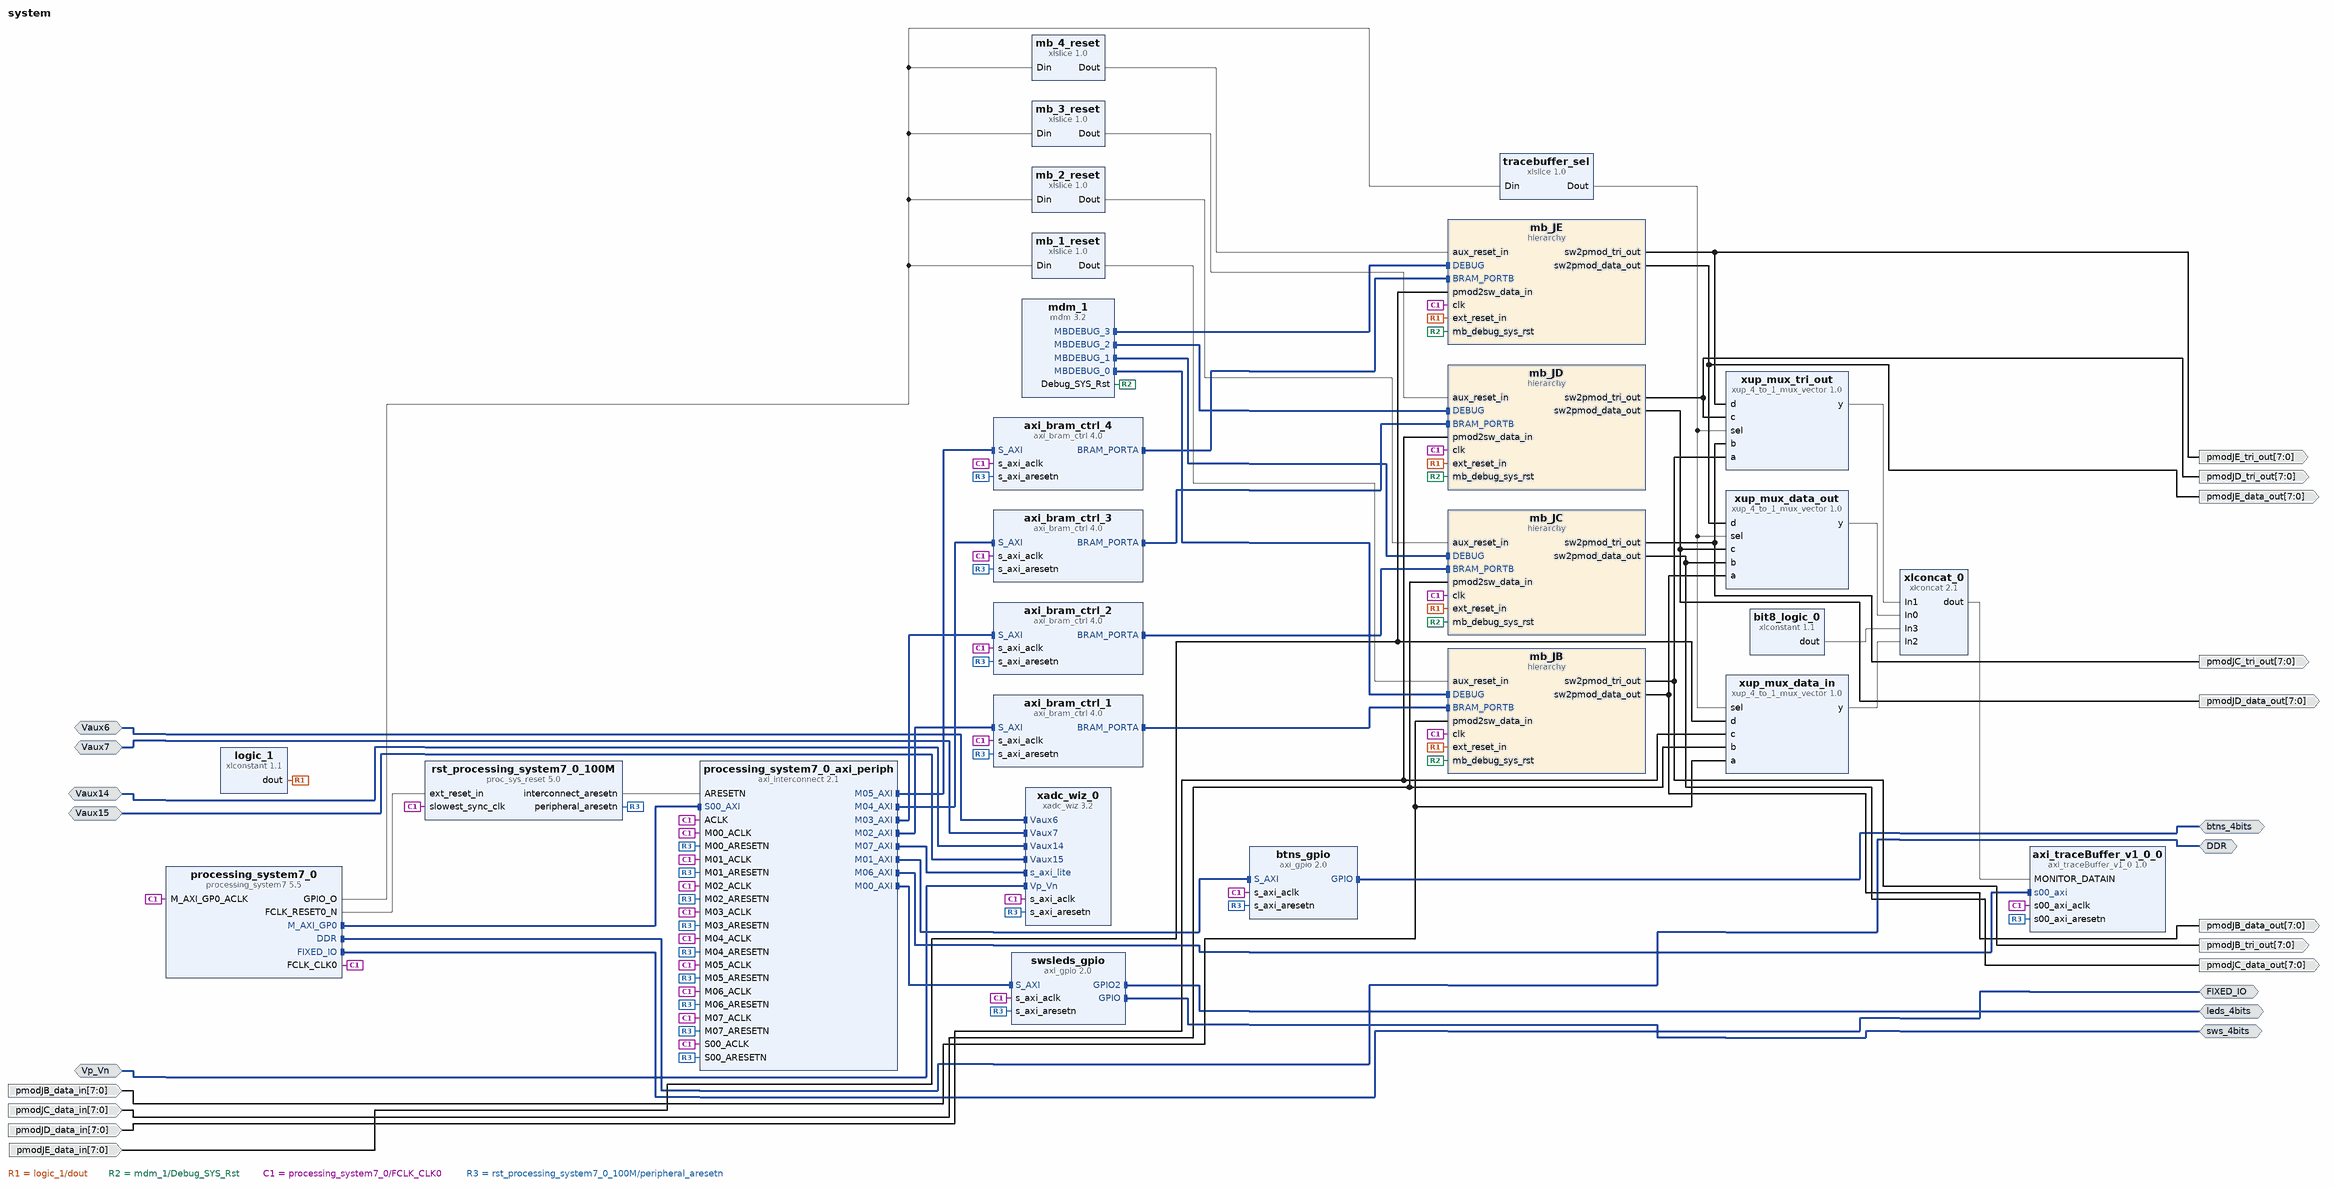
[diagram p0: block diagram of the top level]
# Vivado block design system, Vivado 2015.3
create_bd_design system

create_bd_intf_port -mode Master -vlnv xilinx.com:interface:ddrx_rtl:1.0 DDR
create_bd_intf_port -mode Master -vlnv xilinx.com:display_processing_system7:fixedio_rtl:1.0 FIXED_IO
create_bd_intf_port -mode Slave -vlnv xilinx.com:interface:diff_analog_io_rtl:1.0 Vaux6
create_bd_intf_port -mode Slave -vlnv xilinx.com:interface:diff_analog_io_rtl:1.0 Vaux7
create_bd_intf_port -mode Slave -vlnv xilinx.com:interface:diff_analog_io_rtl:1.0 Vaux14
create_bd_intf_port -mode Slave -vlnv xilinx.com:interface:diff_analog_io_rtl:1.0 Vaux15
create_bd_intf_port -mode Slave -vlnv xilinx.com:interface:diff_analog_io_rtl:1.0 Vp_Vn
create_bd_intf_port -mode Master -vlnv xilinx.com:interface:gpio_rtl:1.0 btns_4bits
create_bd_intf_port -mode Master -vlnv xilinx.com:interface:gpio_rtl:1.0 leds_4bits
create_bd_intf_port -mode Master -vlnv xilinx.com:interface:gpio_rtl:1.0 sws_4bits
create_bd_port -dir I -from 7 -to 0 pmodJB_data_in
create_bd_port -dir O -from 7 -to 0 pmodJB_data_out
create_bd_port -dir O -from 7 -to 0 pmodJB_tri_out
create_bd_port -dir I -from 7 -to 0 pmodJC_data_in
create_bd_port -dir O -from 7 -to 0 pmodJC_data_out
create_bd_port -dir O -from 7 -to 0 pmodJC_tri_out
create_bd_port -dir I -from 7 -to 0 pmodJD_data_in
create_bd_port -dir O -from 7 -to 0 pmodJD_data_out
create_bd_port -dir O -from 7 -to 0 pmodJD_tri_out
create_bd_port -dir I -from 7 -to 0 pmodJE_data_in
create_bd_port -dir O -from 7 -to 0 pmodJE_data_out
create_bd_port -dir O -from 7 -to 0 pmodJE_tri_out

create_bd_cell -type ip -vlnv xilinx.com:ip:axi_bram_ctrl:4.0 axi_bram_ctrl_1
set_property -dict {CONFIG.SINGLE_PORT_BRAM 1} [get_bd_cells axi_bram_ctrl_1]
create_bd_cell -type ip -vlnv xilinx.com:ip:axi_bram_ctrl:4.0 axi_bram_ctrl_2
set_property -dict {CONFIG.SINGLE_PORT_BRAM 1} [get_bd_cells axi_bram_ctrl_2]
create_bd_cell -type ip -vlnv xilinx.com:ip:axi_bram_ctrl:4.0 axi_bram_ctrl_3
set_property -dict {CONFIG.SINGLE_PORT_BRAM 1} [get_bd_cells axi_bram_ctrl_3]
create_bd_cell -type ip -vlnv xilinx.com:ip:axi_bram_ctrl:4.0 axi_bram_ctrl_4
set_property -dict {CONFIG.SINGLE_PORT_BRAM 1} [get_bd_cells axi_bram_ctrl_4]
create_bd_cell -type ip -vlnv xilinx.com:user:axi_traceBuffer_v1_0:1.0 axi_traceBuffer_v1_0_0
create_bd_cell -type ip -vlnv xilinx.com:ip:xlconstant:1.1 bit8_logic_0
set_property -dict {CONFIG.CONST_WIDTH 8 CONFIG.CONST_VAL 0} [get_bd_cells bit8_logic_0]
create_bd_cell -type ip -vlnv xilinx.com:ip:axi_gpio:2.0 btns_gpio
set_property -dict {CONFIG.C_GPIO_WIDTH 4 CONFIG.C_ALL_INPUTS 1} [get_bd_cells btns_gpio]
create_bd_cell -type ip -vlnv xilinx.com:ip:xlconstant:1.1 logic_1
create_bd_cell -type ip -vlnv xilinx.com:ip:xlslice:1.0 mb_1_reset
set_property -dict {CONFIG.DIN_TO 0 CONFIG.DIN_FROM 0 CONFIG.DIN_WIDTH 6} [get_bd_cells mb_1_reset]
create_bd_cell -type ip -vlnv xilinx.com:ip:xlslice:1.0 mb_2_reset
set_property -dict {CONFIG.DOUT_WIDTH 1 CONFIG.DIN_TO 1 CONFIG.DIN_FROM 1 CONFIG.DIN_WIDTH 6} [get_bd_cells mb_2_reset]
create_bd_cell -type ip -vlnv xilinx.com:ip:xlslice:1.0 mb_3_reset
set_property -dict {CONFIG.DOUT_WIDTH 1 CONFIG.DIN_TO 2 CONFIG.DIN_FROM 2 CONFIG.DIN_WIDTH 6} [get_bd_cells mb_3_reset]
create_bd_cell -type ip -vlnv xilinx.com:ip:xlslice:1.0 mb_4_reset
set_property -dict {CONFIG.DOUT_WIDTH 1 CONFIG.DIN_TO 3 CONFIG.DIN_FROM 3 CONFIG.DIN_WIDTH 6} [get_bd_cells mb_4_reset]
create_bd_cell -type hier mb_JB
create_bd_cell -type hier mb_JC
create_bd_cell -type hier mb_JD
create_bd_cell -type hier mb_JE
create_bd_cell -type ip -vlnv xilinx.com:ip:mdm:3.2 mdm_1
set_property -dict {CONFIG.C_MB_DBG_PORTS 4} [get_bd_cells mdm_1]
create_bd_cell -type ip -vlnv xilinx.com:ip:processing_system7:5.5 processing_system7_0
set_property -dict [list \
  CONFIG.PCW_UIPARAM_DDR_FREQ_MHZ 525 \
  CONFIG.PCW_CRYSTAL_PERIPHERAL_FREQMHZ 50.000000 \
  CONFIG.PCW_APU_PERIPHERAL_FREQMHZ 650 \
  CONFIG.PCW_SDIO_PERIPHERAL_FREQMHZ 50 \
  CONFIG.PCW_FPGA0_PERIPHERAL_FREQMHZ 100 \
  CONFIG.PCW_PRESET_BANK1_VOLTAGE {LVCMOS 1.8V} \
  CONFIG.PCW_UIPARAM_DDR_PARTNO {MT41K128M16 JT-125} \
  CONFIG.PCW_QSPI_PERIPHERAL_ENABLE 1 \
  CONFIG.PCW_QSPI_GRP_SINGLE_SS_ENABLE 1 \
  CONFIG.PCW_QSPI_GRP_FBCLK_ENABLE 1 \
  CONFIG.PCW_ENET0_PERIPHERAL_ENABLE 1 \
  CONFIG.PCW_ENET0_ENET0_IO {MIO 16 .. 27} \
  CONFIG.PCW_ENET0_GRP_MDIO_ENABLE 0 \
  CONFIG.PCW_SD0_PERIPHERAL_ENABLE 1 \
  CONFIG.PCW_SD0_GRP_CD_ENABLE 1 \
  CONFIG.PCW_SD0_GRP_CD_IO {MIO 47} \
  CONFIG.PCW_SD0_GRP_WP_ENABLE 1 \
  CONFIG.PCW_UART1_PERIPHERAL_ENABLE 1 \
  CONFIG.PCW_USB0_PERIPHERAL_ENABLE 0 \
  CONFIG.PCW_GPIO_MIO_GPIO_ENABLE 0 \
  CONFIG.PCW_GPIO_EMIO_GPIO_ENABLE 1 \
  CONFIG.PCW_GPIO_EMIO_GPIO_IO 6 \
] [get_bd_cells processing_system7_0]
# 71 more settings of processing_system7_0 are not shown: defaults, MIO pin electricals, DDR timing, and values the tool derives
create_bd_cell -type ip -vlnv xilinx.com:ip:axi_interconnect:2.1 processing_system7_0_axi_periph
set_property -dict {CONFIG.NUM_MI 8} [get_bd_cells processing_system7_0_axi_periph]
create_bd_cell -type ip -vlnv xilinx.com:ip:proc_sys_reset:5.0 rst_processing_system7_0_100M
create_bd_cell -type ip -vlnv xilinx.com:ip:axi_gpio:2.0 swsleds_gpio
set_property -dict [list \
  CONFIG.C_GPIO_WIDTH 4 \
  CONFIG.C_GPIO2_WIDTH 4 \
  CONFIG.C_IS_DUAL 1 \
  CONFIG.C_ALL_INPUTS 1 \
  CONFIG.C_ALL_OUTPUTS_2 1 \
] [get_bd_cells swsleds_gpio]
create_bd_cell -type ip -vlnv xilinx.com:ip:xlslice:1.0 tracebuffer_sel
set_property -dict {CONFIG.DOUT_WIDTH 2 CONFIG.DIN_TO 4 CONFIG.DIN_FROM 5 CONFIG.DIN_WIDTH 6} [get_bd_cells tracebuffer_sel]
create_bd_cell -type ip -vlnv xilinx.com:ip:xadc_wiz:3.2 xadc_wiz_0
set_property -dict [list \
  CONFIG.XADC_STARUP_SELECTION channel_sequencer \
  CONFIG.SEQUENCER_MODE Continuous \
  CONFIG.OT_ALARM false \
  CONFIG.USER_TEMP_ALARM false \
  CONFIG.VCCINT_ALARM false \
  CONFIG.VCCAUX_ALARM false \
  CONFIG.ENABLE_VCCPINT_ALARM false \
  CONFIG.ENABLE_VCCPAUX_ALARM false \
  CONFIG.ENABLE_VCCDDRO_ALARM false \
  CONFIG.SINGLE_CHANNEL_SELECTION TEMPERATURE \
  CONFIG.CHANNEL_AVERAGING 16 \
  CONFIG.EXTERNAL_MUX_CHANNEL VP_VN \
  CONFIG.CHANNEL_ENABLE_VP_VN true \
  CONFIG.CHANNEL_ENABLE_VAUXP6_VAUXN6 true \
  CONFIG.CHANNEL_ENABLE_VAUXP7_VAUXN7 true \
  CONFIG.CHANNEL_ENABLE_VAUXP14_VAUXN14 true \
  CONFIG.CHANNEL_ENABLE_VAUXP15_VAUXN15 true \
  CONFIG.AVERAGE_ENABLE_VP_VN true \
  CONFIG.AVERAGE_ENABLE_VAUXP6_VAUXN6 true \
  CONFIG.AVERAGE_ENABLE_VAUXP7_VAUXN7 true \
  CONFIG.AVERAGE_ENABLE_VAUXP14_VAUXN14 true \
  CONFIG.AVERAGE_ENABLE_VAUXP15_VAUXN15 true \
  CONFIG.BIPOLAR_VAUXP6_VAUXN6 true \
  CONFIG.BIPOLAR_VAUXP7_VAUXN7 true \
  CONFIG.POWER_DOWN_ADCB true \
] [get_bd_cells xadc_wiz_0]
create_bd_cell -type ip -vlnv xilinx.com:ip:xlconcat:2.1 xlconcat_0
set_property -dict {CONFIG.NUM_PORTS 4} [get_bd_cells xlconcat_0]
create_bd_cell -type ip -vlnv xilinx.com:XUP:xup_4_to_1_mux_vector:1.0 xup_mux_data_in
set_property -dict {CONFIG.SIZE 8} [get_bd_cells xup_mux_data_in]
create_bd_cell -type ip -vlnv xilinx.com:XUP:xup_4_to_1_mux_vector:1.0 xup_mux_data_out
set_property -dict {CONFIG.SIZE 8} [get_bd_cells xup_mux_data_out]
create_bd_cell -type ip -vlnv xilinx.com:XUP:xup_4_to_1_mux_vector:1.0 xup_mux_tri_out
set_property -dict {CONFIG.SIZE 8} [get_bd_cells xup_mux_tri_out]

# ---- hierarchy /mb_JB ----
current_bd_instance /mb_JB
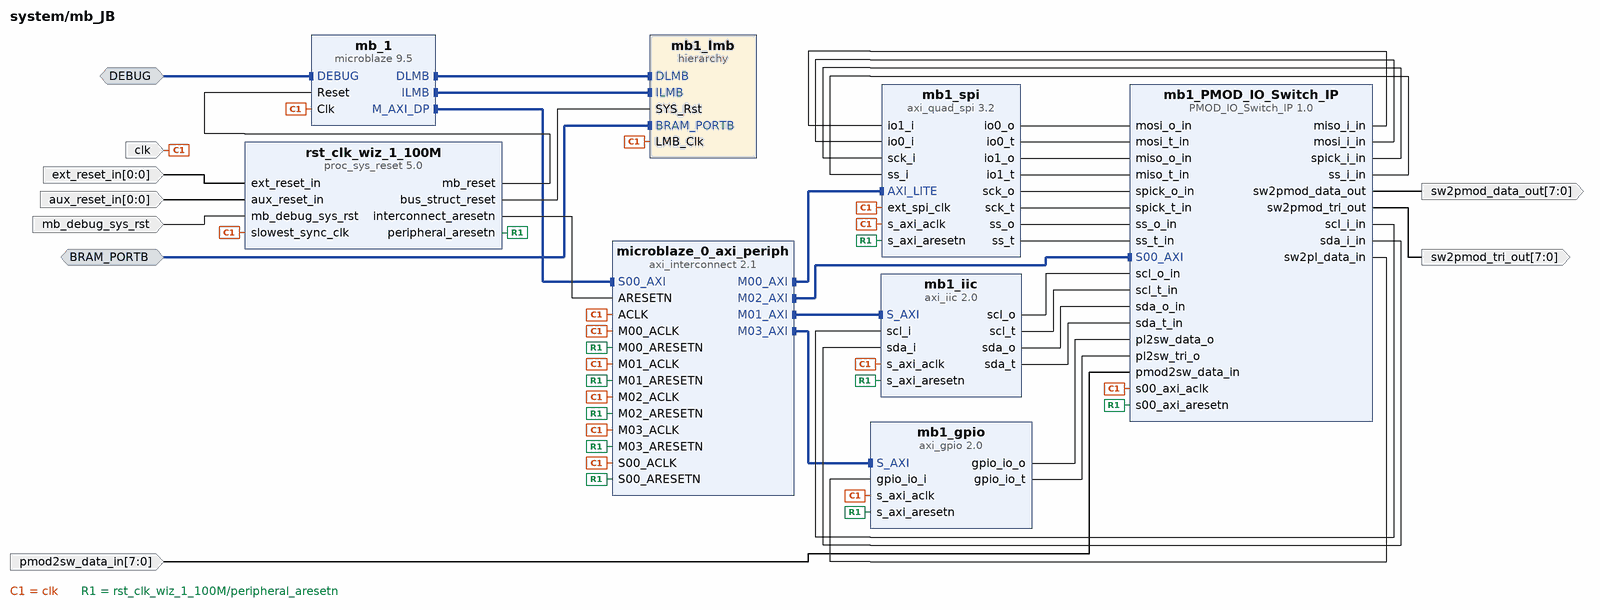
[diagram p1: block diagram inside /mb_JB]
create_bd_intf_pin -mode Slave -vlnv xilinx.com:interface:bram_rtl:1.0 BRAM_PORTB
create_bd_intf_pin -mode Slave -vlnv xilinx.com:interface:mbdebug_rtl:3.0 DEBUG
create_bd_pin -dir I -from 0 -to 0 -type rst aux_reset_in
create_bd_pin -dir I -type clk clk
create_bd_pin -dir I -from 0 -to 0 -type rst ext_reset_in
create_bd_pin -dir I -type rst mb_debug_sys_rst
create_bd_pin -dir I -from 7 -to 0 pmod2sw_data_in
create_bd_pin -dir O -from 7 -to 0 sw2pmod_data_out
create_bd_pin -dir O -from 7 -to 0 sw2pmod_tri_out

create_bd_cell -type ip -vlnv xilinx.com:user:PMOD_IO_Switch_IP:1.0 mb1_PMOD_IO_Switch_IP
create_bd_cell -type ip -vlnv xilinx.com:ip:axi_gpio:2.0 mb1_gpio
set_property -dict {CONFIG.C_GPIO_WIDTH 8} [get_bd_cells mb1_gpio]
create_bd_cell -type ip -vlnv xilinx.com:ip:axi_iic:2.0 mb1_iic
create_bd_cell -type hier mb1_lmb
create_bd_cell -type ip -vlnv xilinx.com:ip:axi_quad_spi:3.2 mb1_spi
set_property -dict {CONFIG.C_USE_STARTUP 0} [get_bd_cells mb1_spi]
create_bd_cell -type ip -vlnv xilinx.com:ip:microblaze:9.5 mb_1
set_property -dict {CONFIG.C_D_AXI 1 CONFIG.C_D_LMB 1 CONFIG.C_I_LMB 1 CONFIG.C_DEBUG_ENABLED 1} [get_bd_cells mb_1]
create_bd_cell -type ip -vlnv xilinx.com:ip:axi_interconnect:2.1 microblaze_0_axi_periph
set_property -dict {CONFIG.NUM_MI 4} [get_bd_cells microblaze_0_axi_periph]
create_bd_cell -type ip -vlnv xilinx.com:ip:proc_sys_reset:5.0 rst_clk_wiz_1_100M
set_property -dict {CONFIG.C_AUX_RESET_HIGH 1} [get_bd_cells rst_clk_wiz_1_100M]

# ---- hierarchy /mb_JB/mb1_lmb ----
current_bd_instance /mb_JB/mb1_lmb
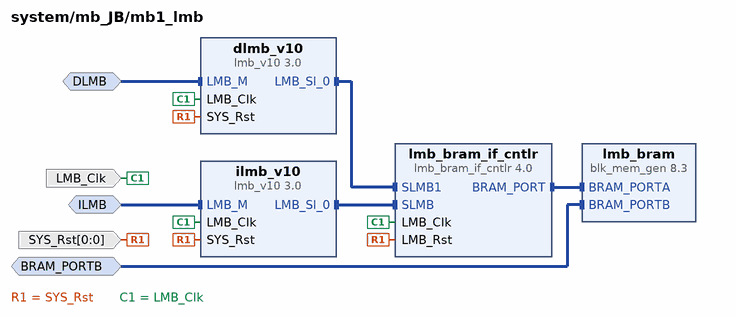
[diagram p2: block diagram inside /mb_JB/mb1_lmb]
create_bd_intf_pin -mode Slave -vlnv xilinx.com:interface:bram_rtl:1.0 BRAM_PORTB
create_bd_intf_pin -mode MirroredMaster -vlnv xilinx.com:interface:lmb_rtl:1.0 DLMB
create_bd_intf_pin -mode MirroredMaster -vlnv xilinx.com:interface:lmb_rtl:1.0 ILMB
create_bd_pin -dir I -type clk LMB_Clk
create_bd_pin -dir I -from 0 -to 0 -type rst SYS_Rst

create_bd_cell -type ip -vlnv xilinx.com:ip:lmb_v10:3.0 dlmb_v10
create_bd_cell -type ip -vlnv xilinx.com:ip:lmb_v10:3.0 ilmb_v10
create_bd_cell -type ip -vlnv xilinx.com:ip:blk_mem_gen:8.3 lmb_bram
set_property -dict {CONFIG.Memory_Type True_Dual_Port_RAM CONFIG.use_bram_block BRAM_Controller} [get_bd_cells lmb_bram]
create_bd_cell -type ip -vlnv xilinx.com:ip:lmb_bram_if_cntlr:4.0 lmb_bram_if_cntlr
set_property -dict {CONFIG.C_NUM_LMB 2 CONFIG.C_ECC 0} [get_bd_cells lmb_bram_if_cntlr]

# ---- hierarchy /mb_JC ----
current_bd_instance /mb_JC
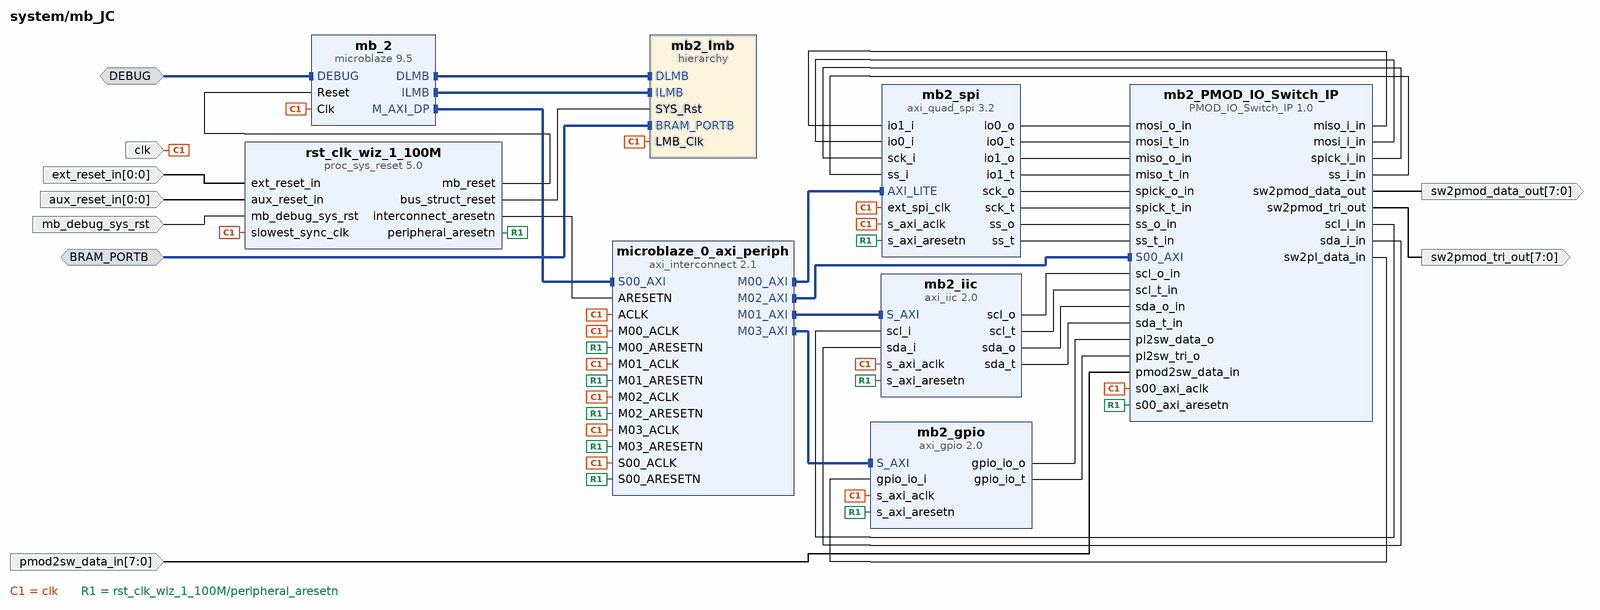
[diagram p3: block diagram inside /mb_JC]
create_bd_intf_pin -mode Slave -vlnv xilinx.com:interface:bram_rtl:1.0 BRAM_PORTB
create_bd_intf_pin -mode Slave -vlnv xilinx.com:interface:mbdebug_rtl:3.0 DEBUG
create_bd_pin -dir I -from 0 -to 0 -type rst aux_reset_in
create_bd_pin -dir I -type clk clk
create_bd_pin -dir I -from 0 -to 0 -type rst ext_reset_in
create_bd_pin -dir I -type rst mb_debug_sys_rst
create_bd_pin -dir I -from 7 -to 0 pmod2sw_data_in
create_bd_pin -dir O -from 7 -to 0 sw2pmod_data_out
create_bd_pin -dir O -from 7 -to 0 sw2pmod_tri_out

create_bd_cell -type ip -vlnv xilinx.com:user:PMOD_IO_Switch_IP:1.0 mb2_PMOD_IO_Switch_IP
create_bd_cell -type ip -vlnv xilinx.com:ip:axi_gpio:2.0 mb2_gpio
set_property -dict {CONFIG.C_GPIO_WIDTH 8} [get_bd_cells mb2_gpio]
create_bd_cell -type ip -vlnv xilinx.com:ip:axi_iic:2.0 mb2_iic
create_bd_cell -type hier mb2_lmb
create_bd_cell -type ip -vlnv xilinx.com:ip:axi_quad_spi:3.2 mb2_spi
set_property -dict {CONFIG.C_USE_STARTUP 0} [get_bd_cells mb2_spi]
create_bd_cell -type ip -vlnv xilinx.com:ip:microblaze:9.5 mb_2
set_property -dict {CONFIG.C_D_AXI 1 CONFIG.C_D_LMB 1 CONFIG.C_I_LMB 1 CONFIG.C_DEBUG_ENABLED 1} [get_bd_cells mb_2]
create_bd_cell -type ip -vlnv xilinx.com:ip:axi_interconnect:2.1 microblaze_0_axi_periph
set_property -dict {CONFIG.NUM_MI 4} [get_bd_cells microblaze_0_axi_periph]
create_bd_cell -type ip -vlnv xilinx.com:ip:proc_sys_reset:5.0 rst_clk_wiz_1_100M
set_property -dict {CONFIG.C_AUX_RESET_HIGH 1} [get_bd_cells rst_clk_wiz_1_100M]

# ---- hierarchy /mb_JC/mb2_lmb ----
current_bd_instance /mb_JC/mb2_lmb
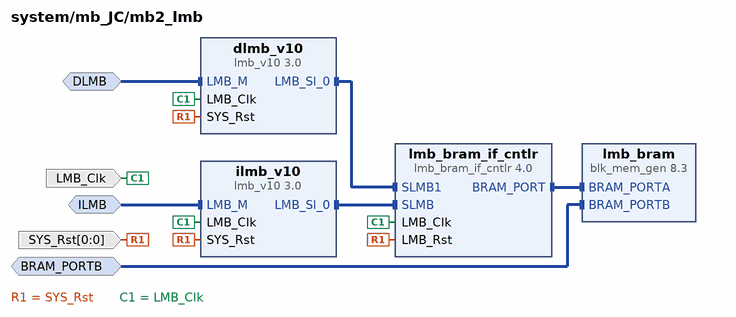
[diagram p4: block diagram inside /mb_JC/mb2_lmb]
create_bd_intf_pin -mode Slave -vlnv xilinx.com:interface:bram_rtl:1.0 BRAM_PORTB
create_bd_intf_pin -mode MirroredMaster -vlnv xilinx.com:interface:lmb_rtl:1.0 DLMB
create_bd_intf_pin -mode MirroredMaster -vlnv xilinx.com:interface:lmb_rtl:1.0 ILMB
create_bd_pin -dir I -type clk LMB_Clk
create_bd_pin -dir I -from 0 -to 0 -type rst SYS_Rst

create_bd_cell -type ip -vlnv xilinx.com:ip:lmb_v10:3.0 dlmb_v10
create_bd_cell -type ip -vlnv xilinx.com:ip:lmb_v10:3.0 ilmb_v10
create_bd_cell -type ip -vlnv xilinx.com:ip:blk_mem_gen:8.3 lmb_bram
set_property -dict {CONFIG.Memory_Type True_Dual_Port_RAM CONFIG.use_bram_block BRAM_Controller} [get_bd_cells lmb_bram]
create_bd_cell -type ip -vlnv xilinx.com:ip:lmb_bram_if_cntlr:4.0 lmb_bram_if_cntlr
set_property -dict {CONFIG.C_NUM_LMB 2 CONFIG.C_ECC 0} [get_bd_cells lmb_bram_if_cntlr]

# ---- hierarchy /mb_JD ----
current_bd_instance /mb_JD
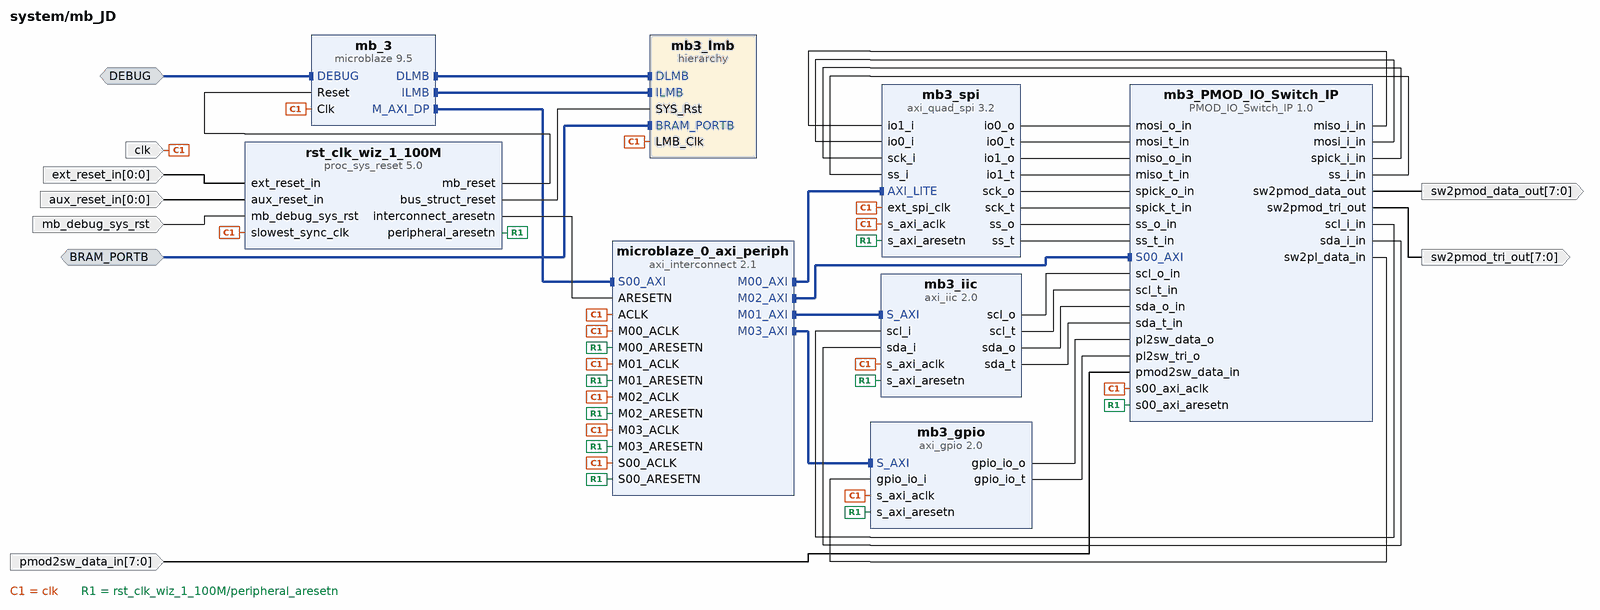
[diagram p5: block diagram inside /mb_JD]
create_bd_intf_pin -mode Slave -vlnv xilinx.com:interface:bram_rtl:1.0 BRAM_PORTB
create_bd_intf_pin -mode Slave -vlnv xilinx.com:interface:mbdebug_rtl:3.0 DEBUG
create_bd_pin -dir I -from 0 -to 0 -type rst aux_reset_in
create_bd_pin -dir I -type clk clk
create_bd_pin -dir I -from 0 -to 0 -type rst ext_reset_in
create_bd_pin -dir I -type rst mb_debug_sys_rst
create_bd_pin -dir I -from 7 -to 0 pmod2sw_data_in
create_bd_pin -dir O -from 7 -to 0 sw2pmod_data_out
create_bd_pin -dir O -from 7 -to 0 sw2pmod_tri_out

create_bd_cell -type ip -vlnv xilinx.com:user:PMOD_IO_Switch_IP:1.0 mb3_PMOD_IO_Switch_IP
create_bd_cell -type ip -vlnv xilinx.com:ip:axi_gpio:2.0 mb3_gpio
set_property -dict {CONFIG.C_GPIO_WIDTH 8} [get_bd_cells mb3_gpio]
create_bd_cell -type ip -vlnv xilinx.com:ip:axi_iic:2.0 mb3_iic
create_bd_cell -type hier mb3_lmb
create_bd_cell -type ip -vlnv xilinx.com:ip:axi_quad_spi:3.2 mb3_spi
set_property -dict {CONFIG.C_USE_STARTUP 0} [get_bd_cells mb3_spi]
create_bd_cell -type ip -vlnv xilinx.com:ip:microblaze:9.5 mb_3
set_property -dict {CONFIG.C_D_AXI 1 CONFIG.C_D_LMB 1 CONFIG.C_I_LMB 1 CONFIG.C_DEBUG_ENABLED 1} [get_bd_cells mb_3]
create_bd_cell -type ip -vlnv xilinx.com:ip:axi_interconnect:2.1 microblaze_0_axi_periph
set_property -dict {CONFIG.NUM_MI 4} [get_bd_cells microblaze_0_axi_periph]
create_bd_cell -type ip -vlnv xilinx.com:ip:proc_sys_reset:5.0 rst_clk_wiz_1_100M
set_property -dict {CONFIG.C_AUX_RESET_HIGH 1} [get_bd_cells rst_clk_wiz_1_100M]

# ---- hierarchy /mb_JD/mb3_lmb ----
current_bd_instance /mb_JD/mb3_lmb
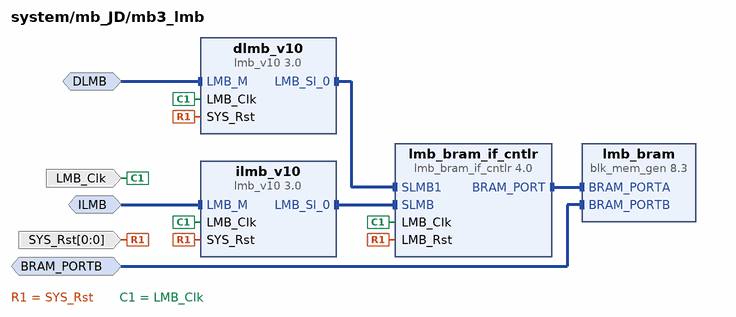
[diagram p6: block diagram inside /mb_JD/mb3_lmb]
create_bd_intf_pin -mode Slave -vlnv xilinx.com:interface:bram_rtl:1.0 BRAM_PORTB
create_bd_intf_pin -mode MirroredMaster -vlnv xilinx.com:interface:lmb_rtl:1.0 DLMB
create_bd_intf_pin -mode MirroredMaster -vlnv xilinx.com:interface:lmb_rtl:1.0 ILMB
create_bd_pin -dir I -type clk LMB_Clk
create_bd_pin -dir I -from 0 -to 0 -type rst SYS_Rst

create_bd_cell -type ip -vlnv xilinx.com:ip:lmb_v10:3.0 dlmb_v10
create_bd_cell -type ip -vlnv xilinx.com:ip:lmb_v10:3.0 ilmb_v10
create_bd_cell -type ip -vlnv xilinx.com:ip:blk_mem_gen:8.3 lmb_bram
set_property -dict {CONFIG.Memory_Type True_Dual_Port_RAM CONFIG.use_bram_block BRAM_Controller} [get_bd_cells lmb_bram]
create_bd_cell -type ip -vlnv xilinx.com:ip:lmb_bram_if_cntlr:4.0 lmb_bram_if_cntlr
set_property -dict {CONFIG.C_NUM_LMB 2 CONFIG.C_ECC 0} [get_bd_cells lmb_bram_if_cntlr]

# ---- hierarchy /mb_JE ----
current_bd_instance /mb_JE
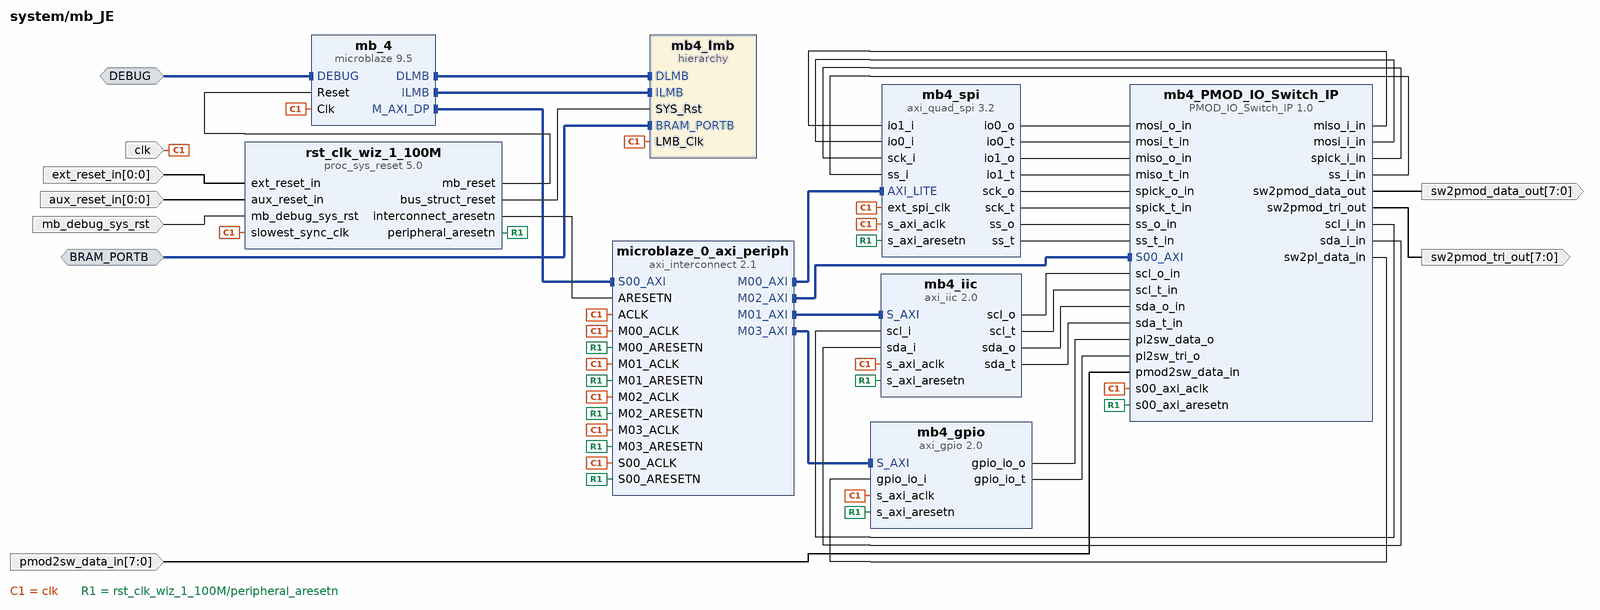
[diagram p7: block diagram inside /mb_JE]
create_bd_intf_pin -mode Slave -vlnv xilinx.com:interface:bram_rtl:1.0 BRAM_PORTB
create_bd_intf_pin -mode Slave -vlnv xilinx.com:interface:mbdebug_rtl:3.0 DEBUG
create_bd_pin -dir I -from 0 -to 0 -type rst aux_reset_in
create_bd_pin -dir I -type clk clk
create_bd_pin -dir I -from 0 -to 0 -type rst ext_reset_in
create_bd_pin -dir I -type rst mb_debug_sys_rst
create_bd_pin -dir I -from 7 -to 0 pmod2sw_data_in
create_bd_pin -dir O -from 7 -to 0 sw2pmod_data_out
create_bd_pin -dir O -from 7 -to 0 sw2pmod_tri_out

create_bd_cell -type ip -vlnv xilinx.com:user:PMOD_IO_Switch_IP:1.0 mb4_PMOD_IO_Switch_IP
create_bd_cell -type ip -vlnv xilinx.com:ip:axi_gpio:2.0 mb4_gpio
set_property -dict {CONFIG.C_GPIO_WIDTH 8} [get_bd_cells mb4_gpio]
create_bd_cell -type ip -vlnv xilinx.com:ip:axi_iic:2.0 mb4_iic
create_bd_cell -type hier mb4_lmb
create_bd_cell -type ip -vlnv xilinx.com:ip:axi_quad_spi:3.2 mb4_spi
set_property -dict {CONFIG.C_USE_STARTUP 0} [get_bd_cells mb4_spi]
create_bd_cell -type ip -vlnv xilinx.com:ip:microblaze:9.5 mb_4
set_property -dict {CONFIG.C_D_AXI 1 CONFIG.C_D_LMB 1 CONFIG.C_I_LMB 1 CONFIG.C_DEBUG_ENABLED 1} [get_bd_cells mb_4]
create_bd_cell -type ip -vlnv xilinx.com:ip:axi_interconnect:2.1 microblaze_0_axi_periph
set_property -dict {CONFIG.NUM_MI 4} [get_bd_cells microblaze_0_axi_periph]
create_bd_cell -type ip -vlnv xilinx.com:ip:proc_sys_reset:5.0 rst_clk_wiz_1_100M
set_property -dict {CONFIG.C_AUX_RESET_HIGH 1} [get_bd_cells rst_clk_wiz_1_100M]

# ---- hierarchy /mb_JE/mb4_lmb ----
current_bd_instance /mb_JE/mb4_lmb
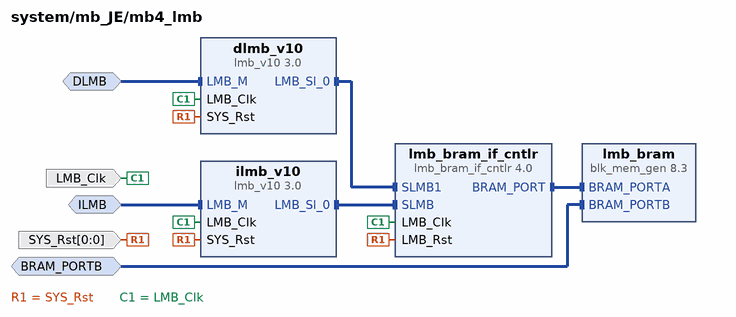
[diagram p8: block diagram inside /mb_JE/mb4_lmb]
create_bd_intf_pin -mode Slave -vlnv xilinx.com:interface:bram_rtl:1.0 BRAM_PORTB
create_bd_intf_pin -mode MirroredMaster -vlnv xilinx.com:interface:lmb_rtl:1.0 DLMB
create_bd_intf_pin -mode MirroredMaster -vlnv xilinx.com:interface:lmb_rtl:1.0 ILMB
create_bd_pin -dir I -type clk LMB_Clk
create_bd_pin -dir I -from 0 -to 0 -type rst SYS_Rst

create_bd_cell -type ip -vlnv xilinx.com:ip:lmb_v10:3.0 dlmb_v10
create_bd_cell -type ip -vlnv xilinx.com:ip:lmb_v10:3.0 ilmb_v10
create_bd_cell -type ip -vlnv xilinx.com:ip:blk_mem_gen:8.3 lmb_bram
set_property -dict {CONFIG.Memory_Type True_Dual_Port_RAM CONFIG.use_bram_block BRAM_Controller} [get_bd_cells lmb_bram]
create_bd_cell -type ip -vlnv xilinx.com:ip:lmb_bram_if_cntlr:4.0 lmb_bram_if_cntlr
set_property -dict {CONFIG.C_NUM_LMB 2 CONFIG.C_ECC 0} [get_bd_cells lmb_bram_if_cntlr]

# ---- connections ----

current_bd_instance /mb_JB
connect_bd_intf_net [get_bd_intf_pins mb_1/M_AXI_DP] [get_bd_intf_pins microblaze_0_axi_periph/S00_AXI]
connect_bd_intf_net [get_bd_intf_pins mb1_spi/AXI_LITE] [get_bd_intf_pins microblaze_0_axi_periph/M00_AXI]
connect_bd_intf_net [get_bd_intf_pins mb1_iic/S_AXI] [get_bd_intf_pins microblaze_0_axi_periph/M01_AXI]
connect_bd_intf_net [get_bd_intf_pins mb1_PMOD_IO_Switch_IP/S00_AXI] [get_bd_intf_pins microblaze_0_axi_periph/M02_AXI]
connect_bd_intf_net [get_bd_intf_pins mb1_gpio/S_AXI] [get_bd_intf_pins microblaze_0_axi_periph/M03_AXI]
connect_bd_intf_net [get_bd_intf_pins mb1_lmb/DLMB] [get_bd_intf_pins mb_1/DLMB]
connect_bd_intf_net [get_bd_intf_pins mb1_lmb/ILMB] [get_bd_intf_pins mb_1/ILMB]
connect_bd_intf_net [get_bd_intf_pins BRAM_PORTB] [get_bd_intf_pins mb1_lmb/BRAM_PORTB]
connect_bd_intf_net [get_bd_intf_pins DEBUG] [get_bd_intf_pins mb_1/DEBUG]
connect_bd_net -net PMOD_IO_Switch_IP_0_miso_i_in [get_bd_pins mb1_PMOD_IO_Switch_IP/miso_i_in] [get_bd_pins mb1_spi/io1_i]
connect_bd_net -net PMOD_IO_Switch_IP_0_mosi_i_in [get_bd_pins mb1_PMOD_IO_Switch_IP/mosi_i_in] [get_bd_pins mb1_spi/io0_i]
connect_bd_net -net PMOD_IO_Switch_IP_0_scl_i_in [get_bd_pins mb1_PMOD_IO_Switch_IP/scl_i_in] [get_bd_pins mb1_iic/scl_i]
connect_bd_net -net PMOD_IO_Switch_IP_0_sda_i_in [get_bd_pins mb1_PMOD_IO_Switch_IP/sda_i_in] [get_bd_pins mb1_iic/sda_i]
connect_bd_net -net PMOD_IO_Switch_IP_0_spick_i_in [get_bd_pins mb1_PMOD_IO_Switch_IP/spick_i_in] [get_bd_pins mb1_spi/sck_i]
connect_bd_net -net PMOD_IO_Switch_IP_0_ss_i_in [get_bd_pins mb1_PMOD_IO_Switch_IP/ss_i_in] [get_bd_pins mb1_spi/ss_i]
connect_bd_net -net PMOD_IO_Switch_IP_0_sw2pl_data_in [get_bd_pins mb1_PMOD_IO_Switch_IP/sw2pl_data_in] [get_bd_pins mb1_gpio/gpio_io_i]
connect_bd_net -net PMOD_IO_Switch_IP_0_sw2pmod_data_out [get_bd_pins mb1_PMOD_IO_Switch_IP/sw2pmod_data_out] [get_bd_pins sw2pmod_data_out]
connect_bd_net -net PMOD_IO_Switch_IP_0_sw2pmod_tri_out [get_bd_pins mb1_PMOD_IO_Switch_IP/sw2pmod_tri_out] [get_bd_pins sw2pmod_tri_out]
connect_bd_net -net logic_1_dout [get_bd_pins ext_reset_in] [get_bd_pins rst_clk_wiz_1_100M/ext_reset_in]
connect_bd_net [get_bd_pins mb1_gpio/gpio_io_o] [get_bd_pins mb1_PMOD_IO_Switch_IP/pl2sw_data_o]
connect_bd_net [get_bd_pins mb1_gpio/gpio_io_t] [get_bd_pins mb1_PMOD_IO_Switch_IP/pl2sw_tri_o]
connect_bd_net [get_bd_pins mb1_iic/scl_o] [get_bd_pins mb1_PMOD_IO_Switch_IP/scl_o_in]
connect_bd_net [get_bd_pins mb1_iic/scl_t] [get_bd_pins mb1_PMOD_IO_Switch_IP/scl_t_in]
connect_bd_net [get_bd_pins mb1_iic/sda_o] [get_bd_pins mb1_PMOD_IO_Switch_IP/sda_o_in]
connect_bd_net [get_bd_pins mb1_iic/sda_t] [get_bd_pins mb1_PMOD_IO_Switch_IP/sda_t_in]
connect_bd_net [get_bd_pins mb1_spi/io0_o] [get_bd_pins mb1_PMOD_IO_Switch_IP/mosi_o_in]
connect_bd_net [get_bd_pins mb1_spi/io0_t] [get_bd_pins mb1_PMOD_IO_Switch_IP/mosi_t_in]
connect_bd_net [get_bd_pins mb1_spi/io1_o] [get_bd_pins mb1_PMOD_IO_Switch_IP/miso_o_in]
connect_bd_net [get_bd_pins mb1_spi/io1_t] [get_bd_pins mb1_PMOD_IO_Switch_IP/miso_t_in]
connect_bd_net [get_bd_pins mb1_spi/sck_o] [get_bd_pins mb1_PMOD_IO_Switch_IP/spick_o_in]
connect_bd_net [get_bd_pins mb1_spi/sck_t] [get_bd_pins mb1_PMOD_IO_Switch_IP/spick_t_in]
connect_bd_net [get_bd_pins mb1_spi/ss_o] [get_bd_pins mb1_PMOD_IO_Switch_IP/ss_o_in]
connect_bd_net [get_bd_pins mb1_spi/ss_t] [get_bd_pins mb1_PMOD_IO_Switch_IP/ss_t_in]
connect_bd_net -net mb_1_reset_Dout [get_bd_pins aux_reset_in] [get_bd_pins rst_clk_wiz_1_100M/aux_reset_in]
connect_bd_net -net mdm_1_debug_sys_rst [get_bd_pins mb_debug_sys_rst] [get_bd_pins rst_clk_wiz_1_100M/mb_debug_sys_rst]
connect_bd_net [get_bd_pins pmod2sw_data_in] [get_bd_pins mb1_PMOD_IO_Switch_IP/pmod2sw_data_in]
connect_bd_net -net processing_system7_0_FCLK_CLK0 [get_bd_pins clk] \
  [get_bd_pins mb1_PMOD_IO_Switch_IP/s00_axi_aclk] [get_bd_pins mb1_gpio/s_axi_aclk] [get_bd_pins mb1_iic/s_axi_aclk] \
  [get_bd_pins mb1_lmb/LMB_Clk] [get_bd_pins mb1_spi/ext_spi_clk] [get_bd_pins mb1_spi/s_axi_aclk] [get_bd_pins mb_1/Clk] \
  [get_bd_pins microblaze_0_axi_periph/ACLK] [get_bd_pins microblaze_0_axi_periph/M00_ACLK] \
  [get_bd_pins microblaze_0_axi_periph/M01_ACLK] [get_bd_pins microblaze_0_axi_periph/M02_ACLK] \
  [get_bd_pins microblaze_0_axi_periph/M03_ACLK] [get_bd_pins microblaze_0_axi_periph/S00_ACLK] \
  [get_bd_pins rst_clk_wiz_1_100M/slowest_sync_clk]
connect_bd_net [get_bd_pins rst_clk_wiz_1_100M/bus_struct_reset] [get_bd_pins mb1_lmb/SYS_Rst]
connect_bd_net [get_bd_pins rst_clk_wiz_1_100M/interconnect_aresetn] [get_bd_pins microblaze_0_axi_periph/ARESETN]
connect_bd_net [get_bd_pins rst_clk_wiz_1_100M/mb_reset] [get_bd_pins mb_1/Reset]
connect_bd_net [get_bd_pins rst_clk_wiz_1_100M/peripheral_aresetn] \
  [get_bd_pins mb1_PMOD_IO_Switch_IP/s00_axi_aresetn] [get_bd_pins mb1_gpio/s_axi_aresetn] \
  [get_bd_pins mb1_iic/s_axi_aresetn] [get_bd_pins mb1_spi/s_axi_aresetn] [get_bd_pins microblaze_0_axi_periph/M00_ARESETN] \
  [get_bd_pins microblaze_0_axi_periph/M01_ARESETN] [get_bd_pins microblaze_0_axi_periph/M02_ARESETN] \
  [get_bd_pins microblaze_0_axi_periph/M03_ARESETN] [get_bd_pins microblaze_0_axi_periph/S00_ARESETN]

current_bd_instance /mb_JB/mb1_lmb
connect_bd_intf_net [get_bd_intf_pins dlmb_v10/LMB_Sl_0] [get_bd_intf_pins lmb_bram_if_cntlr/SLMB1]
connect_bd_intf_net [get_bd_intf_pins lmb_bram/BRAM_PORTA] [get_bd_intf_pins lmb_bram_if_cntlr/BRAM_PORT]
connect_bd_intf_net [get_bd_intf_pins ilmb_v10/LMB_Sl_0] [get_bd_intf_pins lmb_bram_if_cntlr/SLMB]
connect_bd_intf_net [get_bd_intf_pins BRAM_PORTB] [get_bd_intf_pins lmb_bram/BRAM_PORTB]
connect_bd_intf_net [get_bd_intf_pins DLMB] [get_bd_intf_pins dlmb_v10/LMB_M]
connect_bd_intf_net [get_bd_intf_pins ILMB] [get_bd_intf_pins ilmb_v10/LMB_M]
connect_bd_net [get_bd_pins SYS_Rst] [get_bd_pins dlmb_v10/SYS_Rst] [get_bd_pins ilmb_v10/SYS_Rst] [get_bd_pins lmb_bram_if_cntlr/LMB_Rst]
connect_bd_net -net microblaze_0_Clk [get_bd_pins LMB_Clk] \
  [get_bd_pins dlmb_v10/LMB_Clk] [get_bd_pins ilmb_v10/LMB_Clk] [get_bd_pins lmb_bram_if_cntlr/LMB_Clk]

current_bd_instance /mb_JC
connect_bd_intf_net [get_bd_intf_pins mb_2/M_AXI_DP] [get_bd_intf_pins microblaze_0_axi_periph/S00_AXI]
connect_bd_intf_net [get_bd_intf_pins mb2_spi/AXI_LITE] [get_bd_intf_pins microblaze_0_axi_periph/M00_AXI]
connect_bd_intf_net [get_bd_intf_pins mb2_iic/S_AXI] [get_bd_intf_pins microblaze_0_axi_periph/M01_AXI]
connect_bd_intf_net [get_bd_intf_pins mb2_PMOD_IO_Switch_IP/S00_AXI] [get_bd_intf_pins microblaze_0_axi_periph/M02_AXI]
connect_bd_intf_net [get_bd_intf_pins mb2_gpio/S_AXI] [get_bd_intf_pins microblaze_0_axi_periph/M03_AXI]
connect_bd_intf_net [get_bd_intf_pins mb2_lmb/DLMB] [get_bd_intf_pins mb_2/DLMB]
connect_bd_intf_net [get_bd_intf_pins mb2_lmb/ILMB] [get_bd_intf_pins mb_2/ILMB]
connect_bd_intf_net [get_bd_intf_pins BRAM_PORTB] [get_bd_intf_pins mb2_lmb/BRAM_PORTB]
connect_bd_intf_net [get_bd_intf_pins DEBUG] [get_bd_intf_pins mb_2/DEBUG]
connect_bd_net -net PMOD_IO_Switch_IP_0_miso_i_in [get_bd_pins mb2_PMOD_IO_Switch_IP/miso_i_in] [get_bd_pins mb2_spi/io1_i]
connect_bd_net -net PMOD_IO_Switch_IP_0_mosi_i_in [get_bd_pins mb2_PMOD_IO_Switch_IP/mosi_i_in] [get_bd_pins mb2_spi/io0_i]
connect_bd_net -net PMOD_IO_Switch_IP_0_scl_i_in [get_bd_pins mb2_PMOD_IO_Switch_IP/scl_i_in] [get_bd_pins mb2_iic/scl_i]
connect_bd_net -net PMOD_IO_Switch_IP_0_sda_i_in [get_bd_pins mb2_PMOD_IO_Switch_IP/sda_i_in] [get_bd_pins mb2_iic/sda_i]
connect_bd_net -net PMOD_IO_Switch_IP_0_spick_i_in [get_bd_pins mb2_PMOD_IO_Switch_IP/spick_i_in] [get_bd_pins mb2_spi/sck_i]
connect_bd_net -net PMOD_IO_Switch_IP_0_ss_i_in [get_bd_pins mb2_PMOD_IO_Switch_IP/ss_i_in] [get_bd_pins mb2_spi/ss_i]
connect_bd_net -net PMOD_IO_Switch_IP_0_sw2pl_data_in [get_bd_pins mb2_PMOD_IO_Switch_IP/sw2pl_data_in] [get_bd_pins mb2_gpio/gpio_io_i]
connect_bd_net -net PMOD_IO_Switch_IP_0_sw2pmod_data_out [get_bd_pins mb2_PMOD_IO_Switch_IP/sw2pmod_data_out] [get_bd_pins sw2pmod_data_out]
connect_bd_net -net PMOD_IO_Switch_IP_0_sw2pmod_tri_out [get_bd_pins mb2_PMOD_IO_Switch_IP/sw2pmod_tri_out] [get_bd_pins sw2pmod_tri_out]
connect_bd_net -net logic_1_dout [get_bd_pins ext_reset_in] [get_bd_pins rst_clk_wiz_1_100M/ext_reset_in]
connect_bd_net -net mb1_gpio_gpio_io_o [get_bd_pins mb2_gpio/gpio_io_o] [get_bd_pins mb2_PMOD_IO_Switch_IP/pl2sw_data_o]
connect_bd_net -net mb1_gpio_gpio_io_t [get_bd_pins mb2_gpio/gpio_io_t] [get_bd_pins mb2_PMOD_IO_Switch_IP/pl2sw_tri_o]
connect_bd_net -net mb1_iic_scl_o [get_bd_pins mb2_iic/scl_o] [get_bd_pins mb2_PMOD_IO_Switch_IP/scl_o_in]
connect_bd_net -net mb1_iic_scl_t [get_bd_pins mb2_iic/scl_t] [get_bd_pins mb2_PMOD_IO_Switch_IP/scl_t_in]
connect_bd_net -net mb1_iic_sda_o [get_bd_pins mb2_iic/sda_o] [get_bd_pins mb2_PMOD_IO_Switch_IP/sda_o_in]
connect_bd_net -net mb1_iic_sda_t [get_bd_pins mb2_iic/sda_t] [get_bd_pins mb2_PMOD_IO_Switch_IP/sda_t_in]
connect_bd_net -net mb1_spi_io0_o [get_bd_pins mb2_spi/io0_o] [get_bd_pins mb2_PMOD_IO_Switch_IP/mosi_o_in]
connect_bd_net -net mb1_spi_io0_t [get_bd_pins mb2_spi/io0_t] [get_bd_pins mb2_PMOD_IO_Switch_IP/mosi_t_in]
connect_bd_net -net mb1_spi_io1_o [get_bd_pins mb2_spi/io1_o] [get_bd_pins mb2_PMOD_IO_Switch_IP/miso_o_in]
connect_bd_net -net mb1_spi_io1_t [get_bd_pins mb2_spi/io1_t] [get_bd_pins mb2_PMOD_IO_Switch_IP/miso_t_in]
connect_bd_net -net mb1_spi_sck_o [get_bd_pins mb2_spi/sck_o] [get_bd_pins mb2_PMOD_IO_Switch_IP/spick_o_in]
connect_bd_net -net mb1_spi_sck_t [get_bd_pins mb2_spi/sck_t] [get_bd_pins mb2_PMOD_IO_Switch_IP/spick_t_in]
connect_bd_net -net mb1_spi_ss_o [get_bd_pins mb2_spi/ss_o] [get_bd_pins mb2_PMOD_IO_Switch_IP/ss_o_in]
connect_bd_net -net mb1_spi_ss_t [get_bd_pins mb2_spi/ss_t] [get_bd_pins mb2_PMOD_IO_Switch_IP/ss_t_in]
connect_bd_net -net mb_1_reset_Dout [get_bd_pins aux_reset_in] [get_bd_pins rst_clk_wiz_1_100M/aux_reset_in]
connect_bd_net -net mdm_1_debug_sys_rst [get_bd_pins mb_debug_sys_rst] [get_bd_pins rst_clk_wiz_1_100M/mb_debug_sys_rst]
connect_bd_net [get_bd_pins pmod2sw_data_in] [get_bd_pins mb2_PMOD_IO_Switch_IP/pmod2sw_data_in]
connect_bd_net -net processing_system7_0_FCLK_CLK0 [get_bd_pins clk] \
  [get_bd_pins mb2_PMOD_IO_Switch_IP/s00_axi_aclk] [get_bd_pins mb2_gpio/s_axi_aclk] [get_bd_pins mb2_iic/s_axi_aclk] \
  [get_bd_pins mb2_lmb/LMB_Clk] [get_bd_pins mb2_spi/ext_spi_clk] [get_bd_pins mb2_spi/s_axi_aclk] [get_bd_pins mb_2/Clk] \
  [get_bd_pins microblaze_0_axi_periph/ACLK] [get_bd_pins microblaze_0_axi_periph/M00_ACLK] \
  [get_bd_pins microblaze_0_axi_periph/M01_ACLK] [get_bd_pins microblaze_0_axi_periph/M02_ACLK] \
  [get_bd_pins microblaze_0_axi_periph/M03_ACLK] [get_bd_pins microblaze_0_axi_periph/S00_ACLK] \
  [get_bd_pins rst_clk_wiz_1_100M/slowest_sync_clk]
connect_bd_net [get_bd_pins rst_clk_wiz_1_100M/bus_struct_reset] [get_bd_pins mb2_lmb/SYS_Rst]
connect_bd_net [get_bd_pins rst_clk_wiz_1_100M/interconnect_aresetn] [get_bd_pins microblaze_0_axi_periph/ARESETN]
connect_bd_net [get_bd_pins rst_clk_wiz_1_100M/mb_reset] [get_bd_pins mb_2/Reset]
connect_bd_net [get_bd_pins rst_clk_wiz_1_100M/peripheral_aresetn] \
  [get_bd_pins mb2_PMOD_IO_Switch_IP/s00_axi_aresetn] [get_bd_pins mb2_gpio/s_axi_aresetn] \
  [get_bd_pins mb2_iic/s_axi_aresetn] [get_bd_pins mb2_spi/s_axi_aresetn] [get_bd_pins microblaze_0_axi_periph/M00_ARESETN] \
  [get_bd_pins microblaze_0_axi_periph/M01_ARESETN] [get_bd_pins microblaze_0_axi_periph/M02_ARESETN] \
  [get_bd_pins microblaze_0_axi_periph/M03_ARESETN] [get_bd_pins microblaze_0_axi_periph/S00_ARESETN]

current_bd_instance /mb_JC/mb2_lmb
connect_bd_intf_net [get_bd_intf_pins dlmb_v10/LMB_Sl_0] [get_bd_intf_pins lmb_bram_if_cntlr/SLMB1]
connect_bd_intf_net [get_bd_intf_pins lmb_bram/BRAM_PORTA] [get_bd_intf_pins lmb_bram_if_cntlr/BRAM_PORT]
connect_bd_intf_net [get_bd_intf_pins ilmb_v10/LMB_Sl_0] [get_bd_intf_pins lmb_bram_if_cntlr/SLMB]
connect_bd_intf_net [get_bd_intf_pins BRAM_PORTB] [get_bd_intf_pins lmb_bram/BRAM_PORTB]
connect_bd_intf_net [get_bd_intf_pins DLMB] [get_bd_intf_pins dlmb_v10/LMB_M]
connect_bd_intf_net [get_bd_intf_pins ILMB] [get_bd_intf_pins ilmb_v10/LMB_M]
connect_bd_net [get_bd_pins SYS_Rst] [get_bd_pins dlmb_v10/SYS_Rst] [get_bd_pins ilmb_v10/SYS_Rst] [get_bd_pins lmb_bram_if_cntlr/LMB_Rst]
connect_bd_net -net microblaze_0_Clk [get_bd_pins LMB_Clk] \
  [get_bd_pins dlmb_v10/LMB_Clk] [get_bd_pins ilmb_v10/LMB_Clk] [get_bd_pins lmb_bram_if_cntlr/LMB_Clk]

current_bd_instance /mb_JD
connect_bd_intf_net [get_bd_intf_pins mb_3/M_AXI_DP] [get_bd_intf_pins microblaze_0_axi_periph/S00_AXI]
connect_bd_intf_net [get_bd_intf_pins mb3_spi/AXI_LITE] [get_bd_intf_pins microblaze_0_axi_periph/M00_AXI]
connect_bd_intf_net [get_bd_intf_pins mb3_iic/S_AXI] [get_bd_intf_pins microblaze_0_axi_periph/M01_AXI]
connect_bd_intf_net [get_bd_intf_pins mb3_PMOD_IO_Switch_IP/S00_AXI] [get_bd_intf_pins microblaze_0_axi_periph/M02_AXI]
connect_bd_intf_net [get_bd_intf_pins mb3_gpio/S_AXI] [get_bd_intf_pins microblaze_0_axi_periph/M03_AXI]
connect_bd_intf_net [get_bd_intf_pins mb3_lmb/DLMB] [get_bd_intf_pins mb_3/DLMB]
connect_bd_intf_net [get_bd_intf_pins mb3_lmb/ILMB] [get_bd_intf_pins mb_3/ILMB]
connect_bd_intf_net [get_bd_intf_pins BRAM_PORTB] [get_bd_intf_pins mb3_lmb/BRAM_PORTB]
connect_bd_intf_net [get_bd_intf_pins DEBUG] [get_bd_intf_pins mb_3/DEBUG]
connect_bd_net -net PMOD_IO_Switch_IP_0_miso_i_in [get_bd_pins mb3_PMOD_IO_Switch_IP/miso_i_in] [get_bd_pins mb3_spi/io1_i]
connect_bd_net -net PMOD_IO_Switch_IP_0_mosi_i_in [get_bd_pins mb3_PMOD_IO_Switch_IP/mosi_i_in] [get_bd_pins mb3_spi/io0_i]
connect_bd_net -net PMOD_IO_Switch_IP_0_scl_i_in [get_bd_pins mb3_PMOD_IO_Switch_IP/scl_i_in] [get_bd_pins mb3_iic/scl_i]
connect_bd_net -net PMOD_IO_Switch_IP_0_sda_i_in [get_bd_pins mb3_PMOD_IO_Switch_IP/sda_i_in] [get_bd_pins mb3_iic/sda_i]
connect_bd_net -net PMOD_IO_Switch_IP_0_spick_i_in [get_bd_pins mb3_PMOD_IO_Switch_IP/spick_i_in] [get_bd_pins mb3_spi/sck_i]
connect_bd_net -net PMOD_IO_Switch_IP_0_ss_i_in [get_bd_pins mb3_PMOD_IO_Switch_IP/ss_i_in] [get_bd_pins mb3_spi/ss_i]
connect_bd_net -net PMOD_IO_Switch_IP_0_sw2pl_data_in [get_bd_pins mb3_PMOD_IO_Switch_IP/sw2pl_data_in] [get_bd_pins mb3_gpio/gpio_io_i]
connect_bd_net -net PMOD_IO_Switch_IP_0_sw2pmod_data_out [get_bd_pins mb3_PMOD_IO_Switch_IP/sw2pmod_data_out] [get_bd_pins sw2pmod_data_out]
connect_bd_net -net PMOD_IO_Switch_IP_0_sw2pmod_tri_out [get_bd_pins mb3_PMOD_IO_Switch_IP/sw2pmod_tri_out] [get_bd_pins sw2pmod_tri_out]
connect_bd_net -net logic_1_dout [get_bd_pins ext_reset_in] [get_bd_pins rst_clk_wiz_1_100M/ext_reset_in]
connect_bd_net -net mb1_gpio_gpio_io_o [get_bd_pins mb3_gpio/gpio_io_o] [get_bd_pins mb3_PMOD_IO_Switch_IP/pl2sw_data_o]
connect_bd_net -net mb1_gpio_gpio_io_t [get_bd_pins mb3_gpio/gpio_io_t] [get_bd_pins mb3_PMOD_IO_Switch_IP/pl2sw_tri_o]
connect_bd_net -net mb1_iic_scl_o [get_bd_pins mb3_iic/scl_o] [get_bd_pins mb3_PMOD_IO_Switch_IP/scl_o_in]
connect_bd_net -net mb1_iic_scl_t [get_bd_pins mb3_iic/scl_t] [get_bd_pins mb3_PMOD_IO_Switch_IP/scl_t_in]
connect_bd_net -net mb1_iic_sda_o [get_bd_pins mb3_iic/sda_o] [get_bd_pins mb3_PMOD_IO_Switch_IP/sda_o_in]
connect_bd_net -net mb1_iic_sda_t [get_bd_pins mb3_iic/sda_t] [get_bd_pins mb3_PMOD_IO_Switch_IP/sda_t_in]
connect_bd_net -net mb1_spi_io0_o [get_bd_pins mb3_spi/io0_o] [get_bd_pins mb3_PMOD_IO_Switch_IP/mosi_o_in]
connect_bd_net -net mb1_spi_io0_t [get_bd_pins mb3_spi/io0_t] [get_bd_pins mb3_PMOD_IO_Switch_IP/mosi_t_in]
connect_bd_net -net mb1_spi_io1_o [get_bd_pins mb3_spi/io1_o] [get_bd_pins mb3_PMOD_IO_Switch_IP/miso_o_in]
connect_bd_net -net mb1_spi_io1_t [get_bd_pins mb3_spi/io1_t] [get_bd_pins mb3_PMOD_IO_Switch_IP/miso_t_in]
connect_bd_net -net mb1_spi_sck_o [get_bd_pins mb3_spi/sck_o] [get_bd_pins mb3_PMOD_IO_Switch_IP/spick_o_in]
connect_bd_net -net mb1_spi_sck_t [get_bd_pins mb3_spi/sck_t] [get_bd_pins mb3_PMOD_IO_Switch_IP/spick_t_in]
connect_bd_net -net mb1_spi_ss_o [get_bd_pins mb3_spi/ss_o] [get_bd_pins mb3_PMOD_IO_Switch_IP/ss_o_in]
connect_bd_net -net mb1_spi_ss_t [get_bd_pins mb3_spi/ss_t] [get_bd_pins mb3_PMOD_IO_Switch_IP/ss_t_in]
connect_bd_net -net mb_1_reset_Dout [get_bd_pins aux_reset_in] [get_bd_pins rst_clk_wiz_1_100M/aux_reset_in]
connect_bd_net -net mdm_1_debug_sys_rst [get_bd_pins mb_debug_sys_rst] [get_bd_pins rst_clk_wiz_1_100M/mb_debug_sys_rst]
connect_bd_net [get_bd_pins pmod2sw_data_in] [get_bd_pins mb3_PMOD_IO_Switch_IP/pmod2sw_data_in]
connect_bd_net -net processing_system7_0_FCLK_CLK0 [get_bd_pins clk] \
  [get_bd_pins mb3_PMOD_IO_Switch_IP/s00_axi_aclk] [get_bd_pins mb3_gpio/s_axi_aclk] [get_bd_pins mb3_iic/s_axi_aclk] \
  [get_bd_pins mb3_lmb/LMB_Clk] [get_bd_pins mb3_spi/ext_spi_clk] [get_bd_pins mb3_spi/s_axi_aclk] [get_bd_pins mb_3/Clk] \
  [get_bd_pins microblaze_0_axi_periph/ACLK] [get_bd_pins microblaze_0_axi_periph/M00_ACLK] \
  [get_bd_pins microblaze_0_axi_periph/M01_ACLK] [get_bd_pins microblaze_0_axi_periph/M02_ACLK] \
  [get_bd_pins microblaze_0_axi_periph/M03_ACLK] [get_bd_pins microblaze_0_axi_periph/S00_ACLK] \
  [get_bd_pins rst_clk_wiz_1_100M/slowest_sync_clk]
connect_bd_net [get_bd_pins rst_clk_wiz_1_100M/bus_struct_reset] [get_bd_pins mb3_lmb/SYS_Rst]
connect_bd_net [get_bd_pins rst_clk_wiz_1_100M/interconnect_aresetn] [get_bd_pins microblaze_0_axi_periph/ARESETN]
connect_bd_net [get_bd_pins rst_clk_wiz_1_100M/mb_reset] [get_bd_pins mb_3/Reset]
connect_bd_net [get_bd_pins rst_clk_wiz_1_100M/peripheral_aresetn] \
  [get_bd_pins mb3_PMOD_IO_Switch_IP/s00_axi_aresetn] [get_bd_pins mb3_gpio/s_axi_aresetn] \
  [get_bd_pins mb3_iic/s_axi_aresetn] [get_bd_pins mb3_spi/s_axi_aresetn] [get_bd_pins microblaze_0_axi_periph/M00_ARESETN] \
  [get_bd_pins microblaze_0_axi_periph/M01_ARESETN] [get_bd_pins microblaze_0_axi_periph/M02_ARESETN] \
  [get_bd_pins microblaze_0_axi_periph/M03_ARESETN] [get_bd_pins microblaze_0_axi_periph/S00_ARESETN]

current_bd_instance /mb_JD/mb3_lmb
connect_bd_intf_net [get_bd_intf_pins dlmb_v10/LMB_Sl_0] [get_bd_intf_pins lmb_bram_if_cntlr/SLMB1]
connect_bd_intf_net [get_bd_intf_pins lmb_bram/BRAM_PORTA] [get_bd_intf_pins lmb_bram_if_cntlr/BRAM_PORT]
connect_bd_intf_net [get_bd_intf_pins ilmb_v10/LMB_Sl_0] [get_bd_intf_pins lmb_bram_if_cntlr/SLMB]
connect_bd_intf_net [get_bd_intf_pins BRAM_PORTB] [get_bd_intf_pins lmb_bram/BRAM_PORTB]
connect_bd_intf_net [get_bd_intf_pins DLMB] [get_bd_intf_pins dlmb_v10/LMB_M]
connect_bd_intf_net [get_bd_intf_pins ILMB] [get_bd_intf_pins ilmb_v10/LMB_M]
connect_bd_net [get_bd_pins SYS_Rst] [get_bd_pins dlmb_v10/SYS_Rst] [get_bd_pins ilmb_v10/SYS_Rst] [get_bd_pins lmb_bram_if_cntlr/LMB_Rst]
connect_bd_net -net microblaze_0_Clk [get_bd_pins LMB_Clk] \
  [get_bd_pins dlmb_v10/LMB_Clk] [get_bd_pins ilmb_v10/LMB_Clk] [get_bd_pins lmb_bram_if_cntlr/LMB_Clk]

current_bd_instance /mb_JE
connect_bd_intf_net [get_bd_intf_pins mb_4/M_AXI_DP] [get_bd_intf_pins microblaze_0_axi_periph/S00_AXI]
connect_bd_intf_net [get_bd_intf_pins mb4_spi/AXI_LITE] [get_bd_intf_pins microblaze_0_axi_periph/M00_AXI]
connect_bd_intf_net [get_bd_intf_pins mb4_iic/S_AXI] [get_bd_intf_pins microblaze_0_axi_periph/M01_AXI]
connect_bd_intf_net [get_bd_intf_pins mb4_PMOD_IO_Switch_IP/S00_AXI] [get_bd_intf_pins microblaze_0_axi_periph/M02_AXI]
connect_bd_intf_net [get_bd_intf_pins mb4_gpio/S_AXI] [get_bd_intf_pins microblaze_0_axi_periph/M03_AXI]
connect_bd_intf_net [get_bd_intf_pins mb4_lmb/DLMB] [get_bd_intf_pins mb_4/DLMB]
connect_bd_intf_net [get_bd_intf_pins mb4_lmb/ILMB] [get_bd_intf_pins mb_4/ILMB]
connect_bd_intf_net [get_bd_intf_pins BRAM_PORTB] [get_bd_intf_pins mb4_lmb/BRAM_PORTB]
connect_bd_intf_net [get_bd_intf_pins DEBUG] [get_bd_intf_pins mb_4/DEBUG]
connect_bd_net -net PMOD_IO_Switch_IP_0_miso_i_in [get_bd_pins mb4_PMOD_IO_Switch_IP/miso_i_in] [get_bd_pins mb4_spi/io1_i]
connect_bd_net -net PMOD_IO_Switch_IP_0_mosi_i_in [get_bd_pins mb4_PMOD_IO_Switch_IP/mosi_i_in] [get_bd_pins mb4_spi/io0_i]
connect_bd_net -net PMOD_IO_Switch_IP_0_scl_i_in [get_bd_pins mb4_PMOD_IO_Switch_IP/scl_i_in] [get_bd_pins mb4_iic/scl_i]
connect_bd_net -net PMOD_IO_Switch_IP_0_sda_i_in [get_bd_pins mb4_PMOD_IO_Switch_IP/sda_i_in] [get_bd_pins mb4_iic/sda_i]
connect_bd_net -net PMOD_IO_Switch_IP_0_spick_i_in [get_bd_pins mb4_PMOD_IO_Switch_IP/spick_i_in] [get_bd_pins mb4_spi/sck_i]
connect_bd_net -net PMOD_IO_Switch_IP_0_ss_i_in [get_bd_pins mb4_PMOD_IO_Switch_IP/ss_i_in] [get_bd_pins mb4_spi/ss_i]
connect_bd_net -net PMOD_IO_Switch_IP_0_sw2pl_data_in [get_bd_pins mb4_PMOD_IO_Switch_IP/sw2pl_data_in] [get_bd_pins mb4_gpio/gpio_io_i]
connect_bd_net -net PMOD_IO_Switch_IP_0_sw2pmod_data_out [get_bd_pins mb4_PMOD_IO_Switch_IP/sw2pmod_data_out] [get_bd_pins sw2pmod_data_out]
connect_bd_net -net PMOD_IO_Switch_IP_0_sw2pmod_tri_out [get_bd_pins mb4_PMOD_IO_Switch_IP/sw2pmod_tri_out] [get_bd_pins sw2pmod_tri_out]
connect_bd_net -net logic_1_dout [get_bd_pins ext_reset_in] [get_bd_pins rst_clk_wiz_1_100M/ext_reset_in]
connect_bd_net -net mb1_gpio_gpio_io_o [get_bd_pins mb4_gpio/gpio_io_o] [get_bd_pins mb4_PMOD_IO_Switch_IP/pl2sw_data_o]
connect_bd_net -net mb1_gpio_gpio_io_t [get_bd_pins mb4_gpio/gpio_io_t] [get_bd_pins mb4_PMOD_IO_Switch_IP/pl2sw_tri_o]
connect_bd_net -net mb1_iic_scl_o [get_bd_pins mb4_iic/scl_o] [get_bd_pins mb4_PMOD_IO_Switch_IP/scl_o_in]
connect_bd_net -net mb1_iic_scl_t [get_bd_pins mb4_iic/scl_t] [get_bd_pins mb4_PMOD_IO_Switch_IP/scl_t_in]
connect_bd_net -net mb1_iic_sda_o [get_bd_pins mb4_iic/sda_o] [get_bd_pins mb4_PMOD_IO_Switch_IP/sda_o_in]
connect_bd_net -net mb1_iic_sda_t [get_bd_pins mb4_iic/sda_t] [get_bd_pins mb4_PMOD_IO_Switch_IP/sda_t_in]
connect_bd_net -net mb1_spi_io0_o [get_bd_pins mb4_spi/io0_o] [get_bd_pins mb4_PMOD_IO_Switch_IP/mosi_o_in]
connect_bd_net -net mb1_spi_io0_t [get_bd_pins mb4_spi/io0_t] [get_bd_pins mb4_PMOD_IO_Switch_IP/mosi_t_in]
connect_bd_net -net mb1_spi_io1_o [get_bd_pins mb4_spi/io1_o] [get_bd_pins mb4_PMOD_IO_Switch_IP/miso_o_in]
connect_bd_net -net mb1_spi_io1_t [get_bd_pins mb4_spi/io1_t] [get_bd_pins mb4_PMOD_IO_Switch_IP/miso_t_in]
connect_bd_net -net mb1_spi_sck_o [get_bd_pins mb4_spi/sck_o] [get_bd_pins mb4_PMOD_IO_Switch_IP/spick_o_in]
connect_bd_net -net mb1_spi_sck_t [get_bd_pins mb4_spi/sck_t] [get_bd_pins mb4_PMOD_IO_Switch_IP/spick_t_in]
connect_bd_net -net mb1_spi_ss_o [get_bd_pins mb4_spi/ss_o] [get_bd_pins mb4_PMOD_IO_Switch_IP/ss_o_in]
connect_bd_net -net mb1_spi_ss_t [get_bd_pins mb4_spi/ss_t] [get_bd_pins mb4_PMOD_IO_Switch_IP/ss_t_in]
connect_bd_net -net mb_1_reset_Dout [get_bd_pins aux_reset_in] [get_bd_pins rst_clk_wiz_1_100M/aux_reset_in]
connect_bd_net -net mdm_1_debug_sys_rst [get_bd_pins mb_debug_sys_rst] [get_bd_pins rst_clk_wiz_1_100M/mb_debug_sys_rst]
connect_bd_net [get_bd_pins pmod2sw_data_in] [get_bd_pins mb4_PMOD_IO_Switch_IP/pmod2sw_data_in]
connect_bd_net -net processing_system7_0_FCLK_CLK0 [get_bd_pins clk] \
  [get_bd_pins mb4_PMOD_IO_Switch_IP/s00_axi_aclk] [get_bd_pins mb4_gpio/s_axi_aclk] [get_bd_pins mb4_iic/s_axi_aclk] \
  [get_bd_pins mb4_lmb/LMB_Clk] [get_bd_pins mb4_spi/ext_spi_clk] [get_bd_pins mb4_spi/s_axi_aclk] [get_bd_pins mb_4/Clk] \
  [get_bd_pins microblaze_0_axi_periph/ACLK] [get_bd_pins microblaze_0_axi_periph/M00_ACLK] \
  [get_bd_pins microblaze_0_axi_periph/M01_ACLK] [get_bd_pins microblaze_0_axi_periph/M02_ACLK] \
  [get_bd_pins microblaze_0_axi_periph/M03_ACLK] [get_bd_pins microblaze_0_axi_periph/S00_ACLK] \
  [get_bd_pins rst_clk_wiz_1_100M/slowest_sync_clk]
connect_bd_net [get_bd_pins rst_clk_wiz_1_100M/bus_struct_reset] [get_bd_pins mb4_lmb/SYS_Rst]
connect_bd_net [get_bd_pins rst_clk_wiz_1_100M/interconnect_aresetn] [get_bd_pins microblaze_0_axi_periph/ARESETN]
connect_bd_net [get_bd_pins rst_clk_wiz_1_100M/mb_reset] [get_bd_pins mb_4/Reset]
connect_bd_net [get_bd_pins rst_clk_wiz_1_100M/peripheral_aresetn] \
  [get_bd_pins mb4_PMOD_IO_Switch_IP/s00_axi_aresetn] [get_bd_pins mb4_gpio/s_axi_aresetn] \
  [get_bd_pins mb4_iic/s_axi_aresetn] [get_bd_pins mb4_spi/s_axi_aresetn] [get_bd_pins microblaze_0_axi_periph/M00_ARESETN] \
  [get_bd_pins microblaze_0_axi_periph/M01_ARESETN] [get_bd_pins microblaze_0_axi_periph/M02_ARESETN] \
  [get_bd_pins microblaze_0_axi_periph/M03_ARESETN] [get_bd_pins microblaze_0_axi_periph/S00_ARESETN]

current_bd_instance /mb_JE/mb4_lmb
connect_bd_intf_net [get_bd_intf_pins dlmb_v10/LMB_Sl_0] [get_bd_intf_pins lmb_bram_if_cntlr/SLMB1]
connect_bd_intf_net [get_bd_intf_pins lmb_bram/BRAM_PORTA] [get_bd_intf_pins lmb_bram_if_cntlr/BRAM_PORT]
connect_bd_intf_net [get_bd_intf_pins ilmb_v10/LMB_Sl_0] [get_bd_intf_pins lmb_bram_if_cntlr/SLMB]
connect_bd_intf_net [get_bd_intf_pins BRAM_PORTB] [get_bd_intf_pins lmb_bram/BRAM_PORTB]
connect_bd_intf_net [get_bd_intf_pins DLMB] [get_bd_intf_pins dlmb_v10/LMB_M]
connect_bd_intf_net [get_bd_intf_pins ILMB] [get_bd_intf_pins ilmb_v10/LMB_M]
connect_bd_net [get_bd_pins SYS_Rst] [get_bd_pins dlmb_v10/SYS_Rst] [get_bd_pins ilmb_v10/SYS_Rst] [get_bd_pins lmb_bram_if_cntlr/LMB_Rst]
connect_bd_net -net microblaze_0_Clk [get_bd_pins LMB_Clk] \
  [get_bd_pins dlmb_v10/LMB_Clk] [get_bd_pins ilmb_v10/LMB_Clk] [get_bd_pins lmb_bram_if_cntlr/LMB_Clk]
